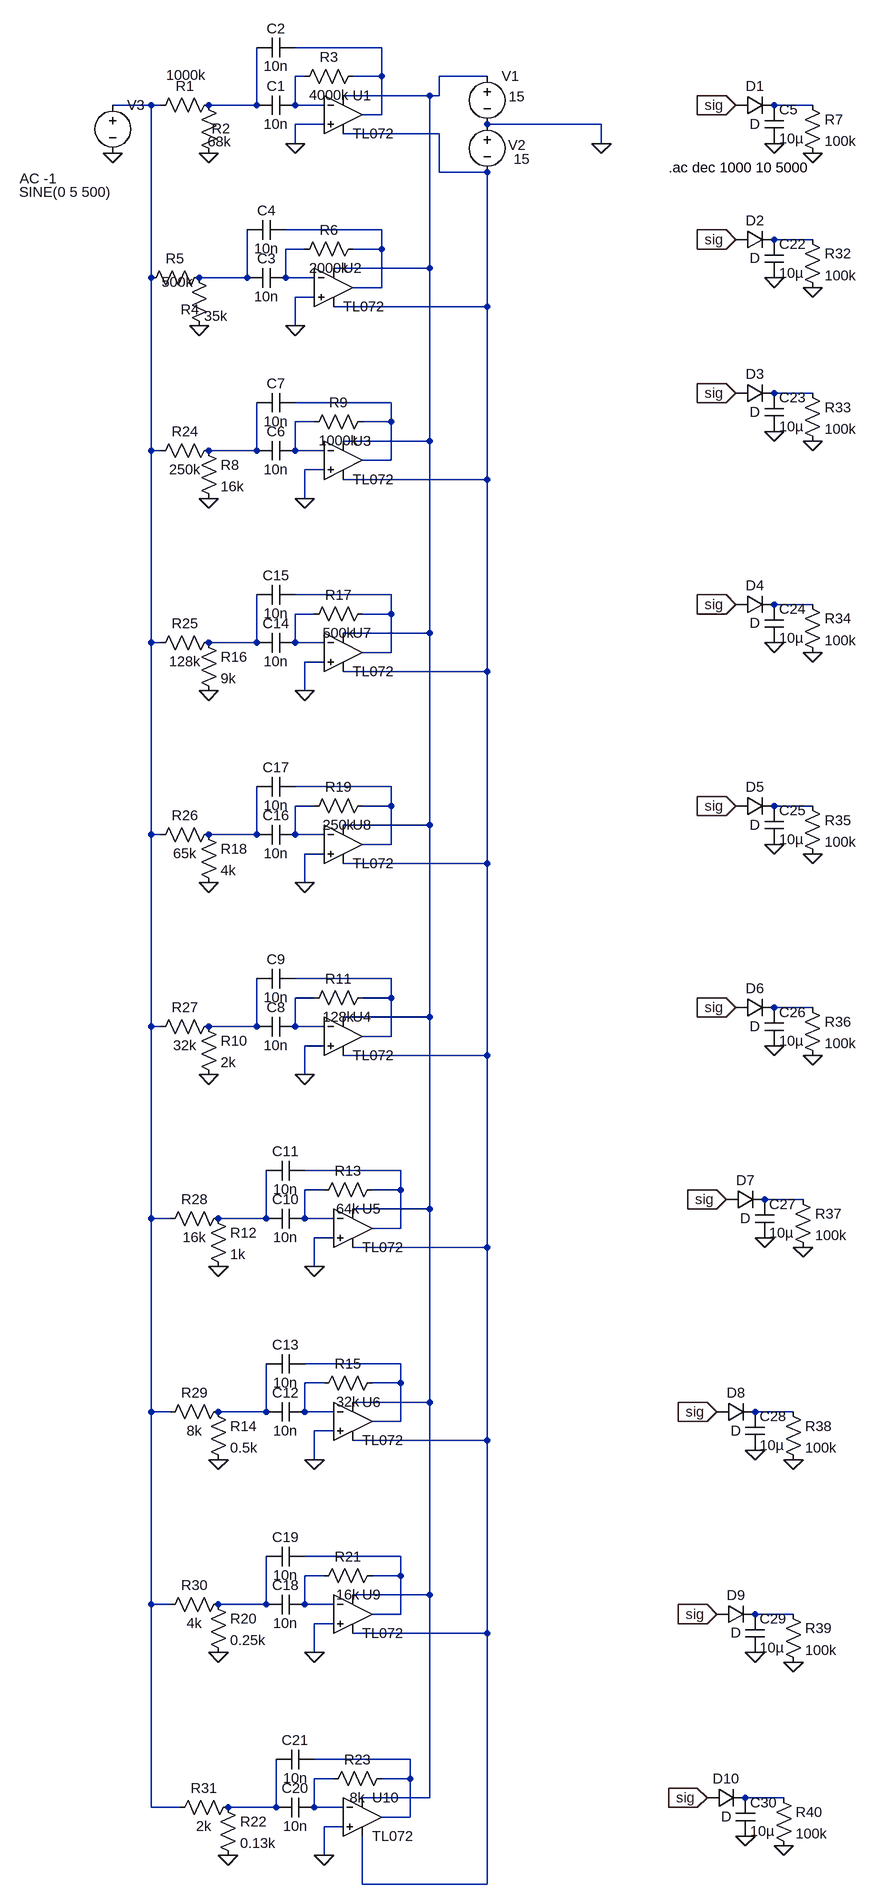
[diagram p0: schematic Filters.asc]
Filters.asc, the LTspice schematic file:
Version 4
SHEET 1 1480 3172
WIRE 96 -64 -48 -64
WIRE -32 -16 -48 -16
WIRE 96 -16 96 -64
WIRE 96 -16 48 -16
WIRE 272 -16 192 -16
WIRE 176 16 32 16
WIRE 192 16 192 -16
WIRE 192 16 176 16
WIRE -288 32 -352 32
WIRE -272 32 -288 32
WIRE -112 32 -112 -64
WIRE -112 32 -192 32
WIRE -48 32 -48 -16
WIRE 0 32 -48 32
WIRE 816 32 752 32
WIRE 96 48 96 -16
WIRE 96 48 64 48
WIRE 0 64 -48 64
WIRE 464 64 272 64
WIRE 192 80 32 80
WIRE -48 96 -48 64
WIRE 464 96 464 64
WIRE 192 144 192 80
WIRE 272 144 192 144
WIRE 96 240 -64 240
WIRE 816 256 752 256
WIRE -32 272 -64 272
WIRE 96 272 96 240
WIRE 96 272 48 272
WIRE 176 304 176 16
WIRE 176 304 16 304
WIRE -288 320 -288 32
WIRE -128 320 -128 240
WIRE -128 320 -208 320
WIRE -64 320 -64 272
WIRE -16 320 -64 320
WIRE 96 336 96 272
WIRE 96 336 48 336
WIRE -16 352 -48 352
WIRE 272 368 272 144
WIRE 272 368 16 368
WIRE -48 400 -48 352
WIRE 816 512 752 512
WIRE 112 528 -48 528
WIRE -16 560 -48 560
WIRE 112 560 112 528
WIRE 112 560 64 560
WIRE 176 592 176 304
WIRE 176 592 32 592
WIRE -288 608 -288 320
WIRE -272 608 -288 608
WIRE -112 608 -112 528
WIRE -112 608 -192 608
WIRE -48 608 -48 560
WIRE 0 608 -48 608
WIRE 112 624 112 560
WIRE 112 624 64 624
WIRE 0 640 -32 640
WIRE 272 656 272 368
WIRE 272 656 32 656
WIRE -32 688 -32 640
WIRE 112 880 -48 880
WIRE 816 896 752 896
WIRE -16 912 -48 912
WIRE 112 912 112 880
WIRE 112 912 64 912
WIRE 176 944 176 592
WIRE 176 944 32 944
WIRE -288 960 -288 608
WIRE -272 960 -288 960
WIRE -112 960 -112 880
WIRE -112 960 -192 960
WIRE -48 960 -48 912
WIRE 0 960 -48 960
WIRE 112 976 112 912
WIRE 112 976 64 976
WIRE 0 992 -32 992
WIRE 272 1008 272 656
WIRE 272 1008 32 1008
WIRE -32 1040 -32 992
WIRE 112 1200 -48 1200
WIRE -16 1232 -48 1232
WIRE 112 1232 112 1200
WIRE 112 1232 64 1232
WIRE 816 1232 752 1232
WIRE 176 1264 176 944
WIRE 176 1264 32 1264
WIRE -288 1280 -288 960
WIRE -272 1280 -288 1280
WIRE -112 1280 -112 1200
WIRE -112 1280 -192 1280
WIRE -48 1280 -48 1232
WIRE 0 1280 -48 1280
WIRE 112 1296 112 1232
WIRE 112 1296 64 1296
WIRE 0 1312 -32 1312
WIRE 272 1328 272 1008
WIRE 272 1328 32 1328
WIRE -32 1360 -32 1312
WIRE 112 1520 -48 1520
WIRE -16 1552 -48 1552
WIRE 112 1552 112 1520
WIRE 112 1552 64 1552
WIRE 816 1568 752 1568
WIRE 176 1584 176 1264
WIRE 176 1584 32 1584
WIRE -288 1600 -288 1280
WIRE -272 1600 -288 1600
WIRE -112 1600 -112 1520
WIRE -112 1600 -192 1600
WIRE -48 1600 -48 1552
WIRE 0 1600 -48 1600
WIRE 112 1616 112 1552
WIRE 112 1616 64 1616
WIRE 0 1632 -32 1632
WIRE 272 1648 272 1328
WIRE 272 1648 32 1648
WIRE -32 1680 -32 1632
WIRE 128 1840 -32 1840
WIRE 0 1872 -32 1872
WIRE 128 1872 128 1840
WIRE 128 1872 80 1872
WIRE 800 1888 736 1888
WIRE 176 1904 176 1584
WIRE 176 1904 48 1904
WIRE -288 1920 -288 1600
WIRE -256 1920 -288 1920
WIRE -96 1920 -96 1840
WIRE -96 1920 -176 1920
WIRE -32 1920 -32 1872
WIRE 16 1920 -32 1920
WIRE 128 1936 128 1872
WIRE 128 1936 80 1936
WIRE 16 1952 -16 1952
WIRE 272 1968 272 1648
WIRE 272 1968 48 1968
WIRE -16 2000 -16 1952
WIRE 128 2192 -32 2192
WIRE 0 2224 -32 2224
WIRE 128 2224 128 2192
WIRE 128 2224 80 2224
WIRE 176 2256 176 1904
WIRE 176 2256 48 2256
WIRE -288 2272 -288 1920
WIRE -256 2272 -288 2272
WIRE -96 2272 -96 2192
WIRE -96 2272 -176 2272
WIRE -32 2272 -32 2224
WIRE 16 2272 -32 2272
WIRE 784 2272 720 2272
WIRE 128 2288 128 2224
WIRE 128 2288 80 2288
WIRE 16 2304 -16 2304
WIRE 272 2320 272 1968
WIRE 272 2320 48 2320
WIRE -16 2352 -16 2304
WIRE 128 2560 -32 2560
WIRE 0 2592 -32 2592
WIRE 128 2592 128 2560
WIRE 128 2592 80 2592
WIRE 176 2624 176 2256
WIRE 176 2624 48 2624
WIRE -288 2640 -288 2272
WIRE -256 2640 -288 2640
WIRE -96 2640 -96 2560
WIRE -96 2640 -176 2640
WIRE -32 2640 -32 2592
WIRE 16 2640 -32 2640
WIRE 128 2656 128 2592
WIRE 128 2656 80 2656
WIRE 784 2656 720 2656
WIRE 16 2672 -16 2672
WIRE 272 2688 272 2320
WIRE 272 2688 48 2688
WIRE -16 2720 -16 2672
WIRE 144 2960 -16 2960
WIRE 16 2992 -16 2992
WIRE 144 2992 144 2960
WIRE 144 2992 96 2992
WIRE 176 3024 176 2624
WIRE 176 3024 64 3024
WIRE 768 3024 704 3024
WIRE -288 3040 -288 2640
WIRE -240 3040 -288 3040
WIRE -80 3040 -80 2960
WIRE -80 3040 -160 3040
WIRE -16 3040 -16 2992
WIRE 32 3040 -16 3040
WIRE 144 3056 144 2992
WIRE 144 3056 96 3056
WIRE 32 3072 0 3072
WIRE 0 3120 0 3072
WIRE 64 3168 64 3088
WIRE 272 3168 272 2688
WIRE 272 3168 64 3168
FLAG -48 96 0
FLAG -192 112 0
FLAG -352 112 0
FLAG 464 96 0
FLAG -208 400 0
FLAG -48 400 0
FLAG 688 32 sig
IOPIN 688 32 In
FLAG 752 96 0
FLAG 816 112 0
FLAG -192 688 0
FLAG -32 688 0
FLAG -192 1680 0
FLAG -32 1680 0
FLAG -176 2000 0
FLAG -16 2000 0
FLAG -176 2352 0
FLAG -16 2352 0
FLAG -192 1040 0
FLAG -32 1040 0
FLAG -192 1360 0
FLAG -32 1360 0
FLAG -176 2720 0
FLAG -16 2720 0
FLAG -160 3120 0
FLAG 0 3120 0
FLAG 688 256 sig
IOPIN 688 256 In
FLAG 752 320 0
FLAG 816 336 0
FLAG 688 512 sig
IOPIN 688 512 In
FLAG 752 576 0
FLAG 816 592 0
FLAG 688 896 sig
IOPIN 688 896 In
FLAG 752 960 0
FLAG 816 976 0
FLAG 688 1232 sig
IOPIN 688 1232 In
FLAG 752 1296 0
FLAG 816 1312 0
FLAG 688 1568 sig
IOPIN 688 1568 In
FLAG 752 1632 0
FLAG 816 1648 0
FLAG 672 1888 sig
IOPIN 672 1888 In
FLAG 736 1952 0
FLAG 800 1968 0
FLAG 656 2272 sig
IOPIN 656 2272 In
FLAG 720 2336 0
FLAG 784 2352 0
FLAG 656 2656 sig
IOPIN 656 2656 In
FLAG 720 2720 0
FLAG 784 2736 0
FLAG 640 3024 sig
IOPIN 640 3024 In
FLAG 704 3088 0
FLAG 768 3104 0
SYMBOL TL072 32 -16 R0
SYMATTR InstName U1
SYMBOL voltage 272 -32 R0
WINDOW 123 0 0 Left 0
WINDOW 39 0 0 Left 0
WINDOW 3 36 50 Left 2
SYMATTR InstName V1
SYMATTR Value 15
SYMBOL voltage 272 48 R0
WINDOW 123 0 0 Left 0
WINDOW 39 0 0 Left 0
WINDOW 0 35 51 Left 2
WINDOW 3 44 74 Left 2
SYMATTR InstName V2
SYMATTR Value 15
SYMBOL res -176 16 R90
WINDOW 0 0 56 VBottom 2
WINDOW 3 -49 54 VTop 2
SYMATTR InstName R1
SYMATTR Value 1000k
SYMBOL res -176 128 R180
WINDOW 0 -20 57 Left 2
WINDOW 3 -21 35 Left 2
SYMATTR InstName R2
SYMATTR Value 68k
SYMBOL cap -112 16 M90
WINDOW 0 0 32 VBottom 2
WINDOW 3 32 32 VTop 2
SYMATTR InstName C1
SYMATTR Value 10n
SYMBOL cap -112 -80 M90
WINDOW 0 0 32 VBottom 2
WINDOW 3 32 32 VTop 2
SYMATTR InstName C2
SYMATTR Value 10n
SYMBOL res 64 -32 R90
WINDOW 0 0 56 VBottom 2
WINDOW 3 32 56 VTop 2
SYMATTR InstName R3
SYMATTR Value 4000k
SYMBOL voltage -352 16 R0
WINDOW 3 -156 161 Left 2
WINDOW 123 -155 139 Left 2
WINDOW 39 0 0 Left 0
SYMATTR Value SINE(0 5 500)
SYMATTR Value2 AC -1
SYMATTR InstName V3
SYMBOL TL072 16 272 R0
SYMATTR InstName U2
SYMBOL res -224 304 R0
WINDOW 0 -15 69 Left 2
WINDOW 3 24 80 Left 2
SYMATTR InstName R4
SYMATTR Value 35k
SYMBOL res -192 304 R90
WINDOW 0 0 56 VBottom 2
WINDOW 3 8 52 VTop 2
SYMATTR InstName R5
SYMATTR Value 500k
SYMBOL cap -64 304 R90
WINDOW 0 0 32 VBottom 2
WINDOW 3 32 32 VTop 2
SYMATTR InstName C3
SYMATTR Value 10n
SYMBOL cap -64 224 R90
WINDOW 0 0 32 VBottom 2
WINDOW 3 32 32 VTop 2
SYMATTR InstName C4
SYMATTR Value 10n
SYMBOL res 64 256 R90
WINDOW 0 0 56 VBottom 2
WINDOW 3 32 56 VTop 2
SYMATTR InstName R6
SYMATTR Value 2000k
SYMBOL diode 688 48 R270
WINDOW 0 32 32 VTop 2
WINDOW 3 0 32 VBottom 2
SYMATTR InstName D1
SYMBOL res 800 16 R0
SYMATTR InstName R7
SYMATTR Value 100k
SYMBOL cap 736 32 R0
SYMATTR InstName C5
SYMATTR Value 10µ
SYMBOL TL072 32 560 R0
SYMATTR InstName U3
SYMBOL res -208 592 R0
SYMATTR InstName R8
SYMATTR Value 16k
SYMBOL cap -48 592 R90
WINDOW 0 0 32 VBottom 2
WINDOW 3 32 32 VTop 2
SYMATTR InstName C6
SYMATTR Value 10n
SYMBOL cap -48 512 R90
WINDOW 0 0 32 VBottom 2
WINDOW 3 32 32 VTop 2
SYMATTR InstName C7
SYMATTR Value 10n
SYMBOL res 80 544 R90
WINDOW 0 0 56 VBottom 2
WINDOW 3 32 56 VTop 2
SYMATTR InstName R9
SYMATTR Value 1000k
SYMBOL TL072 32 1552 R0
SYMATTR InstName U4
SYMBOL res -208 1584 R0
SYMATTR InstName R10
SYMATTR Value 2k
SYMBOL cap -48 1584 R90
WINDOW 0 0 32 VBottom 2
WINDOW 3 32 32 VTop 2
SYMATTR InstName C8
SYMATTR Value 10n
SYMBOL cap -48 1504 R90
WINDOW 0 0 32 VBottom 2
WINDOW 3 32 32 VTop 2
SYMATTR InstName C9
SYMATTR Value 10n
SYMBOL res 80 1536 R90
WINDOW 0 0 56 VBottom 2
WINDOW 3 32 56 VTop 2
SYMATTR InstName R11
SYMATTR Value 128k
SYMBOL TL072 48 1872 R0
SYMATTR InstName U5
SYMBOL res -192 1904 R0
SYMATTR InstName R12
SYMATTR Value 1k
SYMBOL cap -32 1904 R90
WINDOW 0 0 32 VBottom 2
WINDOW 3 32 32 VTop 2
SYMATTR InstName C10
SYMATTR Value 10n
SYMBOL cap -32 1824 R90
WINDOW 0 0 32 VBottom 2
WINDOW 3 32 32 VTop 2
SYMATTR InstName C11
SYMATTR Value 10n
SYMBOL res 96 1856 R90
WINDOW 0 0 56 VBottom 2
WINDOW 3 32 56 VTop 2
SYMATTR InstName R13
SYMATTR Value 64k
SYMBOL TL072 48 2224 R0
SYMATTR InstName U6
SYMBOL res -192 2256 R0
SYMATTR InstName R14
SYMATTR Value 0.5k
SYMBOL cap -32 2256 R90
WINDOW 0 0 32 VBottom 2
WINDOW 3 32 32 VTop 2
SYMATTR InstName C12
SYMATTR Value 10n
SYMBOL cap -32 2176 R90
WINDOW 0 0 32 VBottom 2
WINDOW 3 32 32 VTop 2
SYMATTR InstName C13
SYMATTR Value 10n
SYMBOL res 96 2208 R90
WINDOW 0 0 56 VBottom 2
WINDOW 3 32 56 VTop 2
SYMATTR InstName R15
SYMATTR Value 32k
SYMBOL TL072 32 912 R0
SYMATTR InstName U7
SYMBOL res -208 944 R0
SYMATTR InstName R16
SYMATTR Value 9k
SYMBOL cap -48 944 R90
WINDOW 0 0 32 VBottom 2
WINDOW 3 32 32 VTop 2
SYMATTR InstName C14
SYMATTR Value 10n
SYMBOL cap -48 864 R90
WINDOW 0 0 32 VBottom 2
WINDOW 3 32 32 VTop 2
SYMATTR InstName C15
SYMATTR Value 10n
SYMBOL res 80 896 R90
WINDOW 0 0 56 VBottom 2
WINDOW 3 32 56 VTop 2
SYMATTR InstName R17
SYMATTR Value 500k
SYMBOL TL072 32 1232 R0
SYMATTR InstName U8
SYMBOL res -208 1264 R0
SYMATTR InstName R18
SYMATTR Value 4k
SYMBOL cap -48 1264 R90
WINDOW 0 0 32 VBottom 2
WINDOW 3 32 32 VTop 2
SYMATTR InstName C16
SYMATTR Value 10n
SYMBOL cap -48 1184 R90
WINDOW 0 0 32 VBottom 2
WINDOW 3 32 32 VTop 2
SYMATTR InstName C17
SYMATTR Value 10n
SYMBOL res 80 1216 R90
WINDOW 0 0 56 VBottom 2
WINDOW 3 32 56 VTop 2
SYMATTR InstName R19
SYMATTR Value 250k
SYMBOL TL072 48 2592 R0
SYMATTR InstName U9
SYMBOL res -192 2624 R0
SYMATTR InstName R20
SYMATTR Value 0.25k
SYMBOL cap -32 2624 R90
WINDOW 0 0 32 VBottom 2
WINDOW 3 32 32 VTop 2
SYMATTR InstName C18
SYMATTR Value 10n
SYMBOL cap -32 2544 R90
WINDOW 0 0 32 VBottom 2
WINDOW 3 32 32 VTop 2
SYMATTR InstName C19
SYMATTR Value 10n
SYMBOL res 96 2576 R90
WINDOW 0 0 56 VBottom 2
WINDOW 3 32 56 VTop 2
SYMATTR InstName R21
SYMATTR Value 16k
SYMBOL TL072 64 2992 R0
SYMATTR InstName U10
SYMBOL res -176 3024 R0
SYMATTR InstName R22
SYMATTR Value 0.13k
SYMBOL cap -16 3024 R90
WINDOW 0 0 32 VBottom 2
WINDOW 3 32 32 VTop 2
SYMATTR InstName C20
SYMATTR Value 10n
SYMBOL cap -16 2944 R90
WINDOW 0 0 32 VBottom 2
WINDOW 3 32 32 VTop 2
SYMATTR InstName C21
SYMATTR Value 10n
SYMBOL res 112 2976 R90
WINDOW 0 0 56 VBottom 2
WINDOW 3 32 56 VTop 2
SYMATTR InstName R23
SYMATTR Value 8k
SYMBOL res -176 592 R90
WINDOW 0 0 56 VBottom 2
WINDOW 3 32 56 VTop 2
SYMATTR InstName R24
SYMATTR Value 250k
SYMBOL res -176 944 R90
WINDOW 0 0 56 VBottom 2
WINDOW 3 32 56 VTop 2
SYMATTR InstName R25
SYMATTR Value 128k
SYMBOL res -176 1264 R90
WINDOW 0 0 56 VBottom 2
WINDOW 3 32 56 VTop 2
SYMATTR InstName R26
SYMATTR Value 65k
SYMBOL res -176 1584 R90
WINDOW 0 0 56 VBottom 2
WINDOW 3 32 56 VTop 2
SYMATTR InstName R27
SYMATTR Value 32k
SYMBOL res -160 1904 R90
WINDOW 0 0 56 VBottom 2
WINDOW 3 32 56 VTop 2
SYMATTR InstName R28
SYMATTR Value 16k
SYMBOL res -160 2256 R90
WINDOW 0 0 56 VBottom 2
WINDOW 3 32 56 VTop 2
SYMATTR InstName R29
SYMATTR Value 8k
SYMBOL res -160 2624 R90
WINDOW 0 0 56 VBottom 2
WINDOW 3 32 56 VTop 2
SYMATTR InstName R30
SYMATTR Value 4k
SYMBOL res -144 3024 R90
WINDOW 0 0 56 VBottom 2
WINDOW 3 32 56 VTop 2
SYMATTR InstName R31
SYMATTR Value 2k
SYMBOL diode 688 272 R270
WINDOW 0 32 32 VTop 2
WINDOW 3 0 32 VBottom 2
SYMATTR InstName D2
SYMBOL res 800 240 R0
SYMATTR InstName R32
SYMATTR Value 100k
SYMBOL cap 736 256 R0
SYMATTR InstName C22
SYMATTR Value 10µ
SYMBOL diode 688 528 R270
WINDOW 0 32 32 VTop 2
WINDOW 3 0 32 VBottom 2
SYMATTR InstName D3
SYMBOL res 800 496 R0
SYMATTR InstName R33
SYMATTR Value 100k
SYMBOL cap 736 512 R0
SYMATTR InstName C23
SYMATTR Value 10µ
SYMBOL diode 688 912 R270
WINDOW 0 32 32 VTop 2
WINDOW 3 0 32 VBottom 2
SYMATTR InstName D4
SYMBOL res 800 880 R0
SYMATTR InstName R34
SYMATTR Value 100k
SYMBOL cap 736 896 R0
SYMATTR InstName C24
SYMATTR Value 10µ
SYMBOL diode 688 1248 R270
WINDOW 0 32 32 VTop 2
WINDOW 3 0 32 VBottom 2
SYMATTR InstName D5
SYMBOL res 800 1216 R0
SYMATTR InstName R35
SYMATTR Value 100k
SYMBOL cap 736 1232 R0
SYMATTR InstName C25
SYMATTR Value 10µ
SYMBOL diode 688 1584 R270
WINDOW 0 32 32 VTop 2
WINDOW 3 0 32 VBottom 2
SYMATTR InstName D6
SYMBOL res 800 1552 R0
SYMATTR InstName R36
SYMATTR Value 100k
SYMBOL cap 736 1568 R0
SYMATTR InstName C26
SYMATTR Value 10µ
SYMBOL diode 672 1904 R270
WINDOW 0 32 32 VTop 2
WINDOW 3 0 32 VBottom 2
SYMATTR InstName D7
SYMBOL res 784 1872 R0
SYMATTR InstName R37
SYMATTR Value 100k
SYMBOL cap 720 1888 R0
SYMATTR InstName C27
SYMATTR Value 10µ
SYMBOL diode 656 2288 R270
WINDOW 0 32 32 VTop 2
WINDOW 3 0 32 VBottom 2
SYMATTR InstName D8
SYMBOL res 768 2256 R0
SYMATTR InstName R38
SYMATTR Value 100k
SYMBOL cap 704 2272 R0
SYMATTR InstName C28
SYMATTR Value 10µ
SYMBOL diode 656 2672 R270
WINDOW 0 32 32 VTop 2
WINDOW 3 0 32 VBottom 2
SYMATTR InstName D9
SYMBOL res 768 2640 R0
SYMATTR InstName R39
SYMATTR Value 100k
SYMBOL cap 704 2656 R0
SYMATTR InstName C29
SYMATTR Value 10µ
SYMBOL diode 640 3040 R270
WINDOW 0 32 32 VTop 2
WINDOW 3 0 32 VBottom 2
SYMATTR InstName D10
SYMBOL res 752 3008 R0
SYMATTR InstName R40
SYMATTR Value 100k
SYMBOL cap 688 3024 R0
SYMATTR InstName C30
SYMATTR Value 10µ
TEXT 576 136 Left 2 !.ac dec 1000 10 5000

The netlist it stands for:
* Filters.asc
* U1: TL072 (symbol TL072 not available, pins judged from their places): In+=0 In-=N002 V+=N003 V-=N007 OUT=N001
V1 N003 0 15
V2 0 N007 15
R1 N005 N004 1000k
R2 0 N005 68k
C1 N005 N002 10n
C2 N005 N001 10n
R3 N001 N002 4000k
V3 N004 0 SINE(0 5 500) AC -1
* U2: TL072 (symbol TL072 not available, pins judged from their places): In+=0 In-=N010 V+=N003 V-=N007 OUT=N008
R4 N011 0 35k
R5 N011 N004 500k
C3 N010 N011 10n
C4 N008 N011 10n
R6 N008 N010 2000k
D1 sig N006 D
R7 N006 0 100k
C5 N006 0 10µ
* U3: TL072 (symbol TL072 not available, pins judged from their places): In+=0 In-=N014 V+=N003 V-=N007 OUT=N013
R8 N015 0 16k
C6 N014 N015 10n
C7 N013 N015 10n
R9 N013 N014 1000k
* U4: TL072 (symbol TL072 not available, pins judged from their places): In+=0 In-=N025 V+=N003 V-=N007 OUT=N024
R10 N027 0 2k
C8 N025 N027 10n
C9 N024 N027 10n
R11 N024 N025 128k
* U5: TL072 (symbol TL072 not available, pins judged from their places): In+=0 In-=N029 V+=N003 V-=N007 OUT=N028
R12 N031 0 1k
C10 N029 N031 10n
C11 N028 N031 10n
R13 N028 N029 64k
* U6: TL072 (symbol TL072 not available, pins judged from their places): In+=0 In-=N033 V+=N003 V-=N007 OUT=N032
R14 N034 0 0.5k
C12 N033 N034 10n
C13 N032 N034 10n
R15 N032 N033 32k
* U7: TL072 (symbol TL072 not available, pins judged from their places): In+=0 In-=N018 V+=N003 V-=N007 OUT=N016
R16 N019 0 9k
C14 N018 N019 10n
C15 N016 N019 10n
R17 N016 N018 500k
* U8: TL072 (symbol TL072 not available, pins judged from their places): In+=0 In-=N021 V+=N003 V-=N007 OUT=N020
R18 N023 0 4k
C16 N021 N023 10n
C17 N020 N023 10n
R19 N020 N021 250k
* U9: TL072 (symbol TL072 not available, pins judged from their places): In+=0 In-=N037 V+=N003 V-=N007 OUT=N036
R20 N038 0 0.25k
C18 N037 N038 10n
C19 N036 N038 10n
R21 N036 N037 16k
* U10: TL072 (symbol TL072 not available, pins judged from their places): In+=0 In-=N041 V+=N003 V-=N007 OUT=N040
R22 N043 0 0.13k
C20 N041 N043 10n
C21 N040 N043 10n
R23 N040 N041 8k
R24 N015 N004 250k
R25 N019 N004 128k
R26 N023 N004 65k
R27 N027 N004 32k
R28 N031 N004 16k
R29 N034 N004 8k
R30 N038 N004 4k
R31 N043 N004 2k
D2 sig N009 D
R32 N009 0 100k
C22 N009 0 10µ
D3 sig N012 D
R33 N012 0 100k
C23 N012 0 10µ
D4 sig N017 D
R34 N017 0 100k
C24 N017 0 10µ
D5 sig N022 D
R35 N022 0 100k
C25 N022 0 10µ
D6 sig N026 D
R36 N026 0 100k
C26 N026 0 10µ
D7 sig N030 D
R37 N030 0 100k
C27 N030 0 10µ
D8 sig N035 D
R38 N035 0 100k
C28 N035 0 10µ
D9 sig N039 D
R39 N039 0 100k
C29 N039 0 10µ
D10 sig N042 D
R40 N042 0 100k
C30 N042 0 10µ
.model D D
.lib standard.dio
.ac dec 1000 10 5000
.backanno
.end